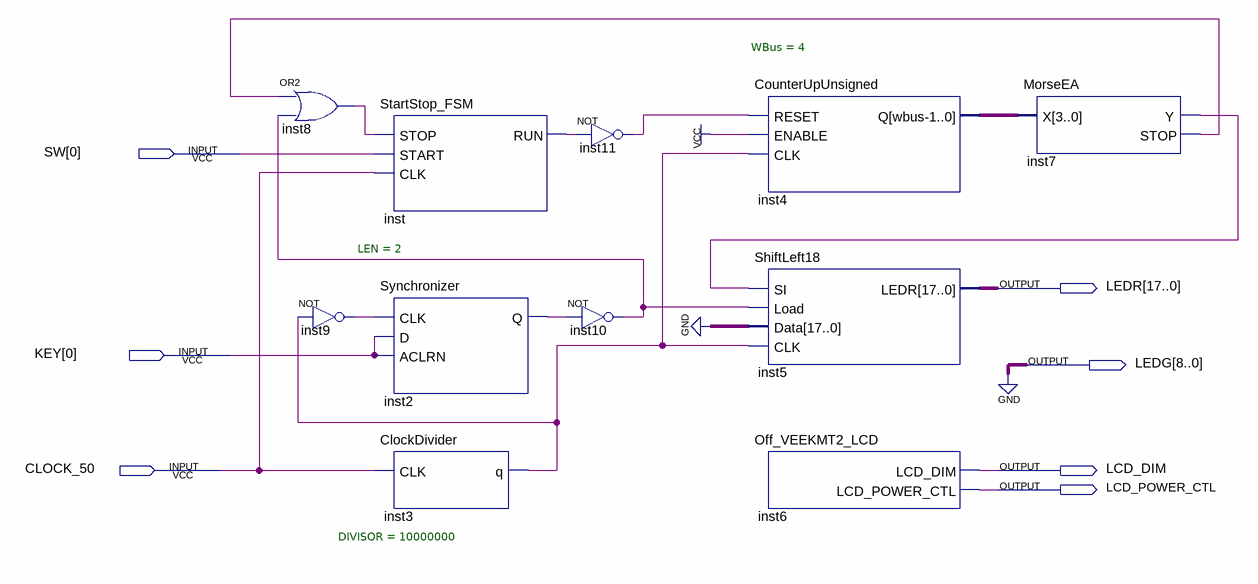
[diagram p0: schematic sheet]
// Quartus schematic morse_ea.bdf as structural Verilog: 11 symbols, 7 pins
module morse_ea (
  input  [0:0] SW,
  input  [0:0] KEY,
  input  CLOCK_50,
  output [17:0] LEDR,
  output [8:0] LEDG,
  output LCD_DIM,
  output LCD_POWER_CTL
);

  wire inst2_q, inst3_q, inst7_stop, inst7_y, inst8_out, inst9_out, inst10_out, inst11_out, inst_run;
  wire [3:0] inst4_q;

  or inst8 (inst8_out, inst7_stop, inst10_out);
  not inst9 (inst9_out, inst3_q);
  StartStop_FSM inst (.STOP(inst8_out), .START(SW[0]), .CLK(CLOCK_50), .RUN(inst_run));
  Synchronizer #(.LEN(2)) inst2 (.CLK(inst9_out), .D(KEY[0]), .ACLRN(KEY[0]), .Q(inst2_q));
  ClockDivider #(.DIVISOR(10000000)) inst3 (.CLK(CLOCK_50), .q(inst3_q));
  not inst11 (inst11_out, inst_run);
  not inst10 (inst10_out, inst2_q);
  CounterUpUnsigned #(.WBus(4)) inst4 (.RESET(inst11_out), .ENABLE(1'b1), .CLK(inst3_q), .Q(inst4_q));
  ShiftLeft18 inst5 (.SI(inst7_y), .Load(inst10_out), .Data({18{1'b0}}), .CLK(inst3_q), .LEDR(LEDR));
  Off_VEEKMT2_LCD inst6 (.LCD_DIM(LCD_DIM), .LCD_POWER_CTL(LCD_POWER_CTL));
  MorseEA inst7 (.X(inst4_q), .Y(inst7_y), .STOP(inst7_stop));

  assign LEDG = {9{1'b0}};
endmodule
